# Altium schematic sheet PowerAndClock.SchDoc
size A4
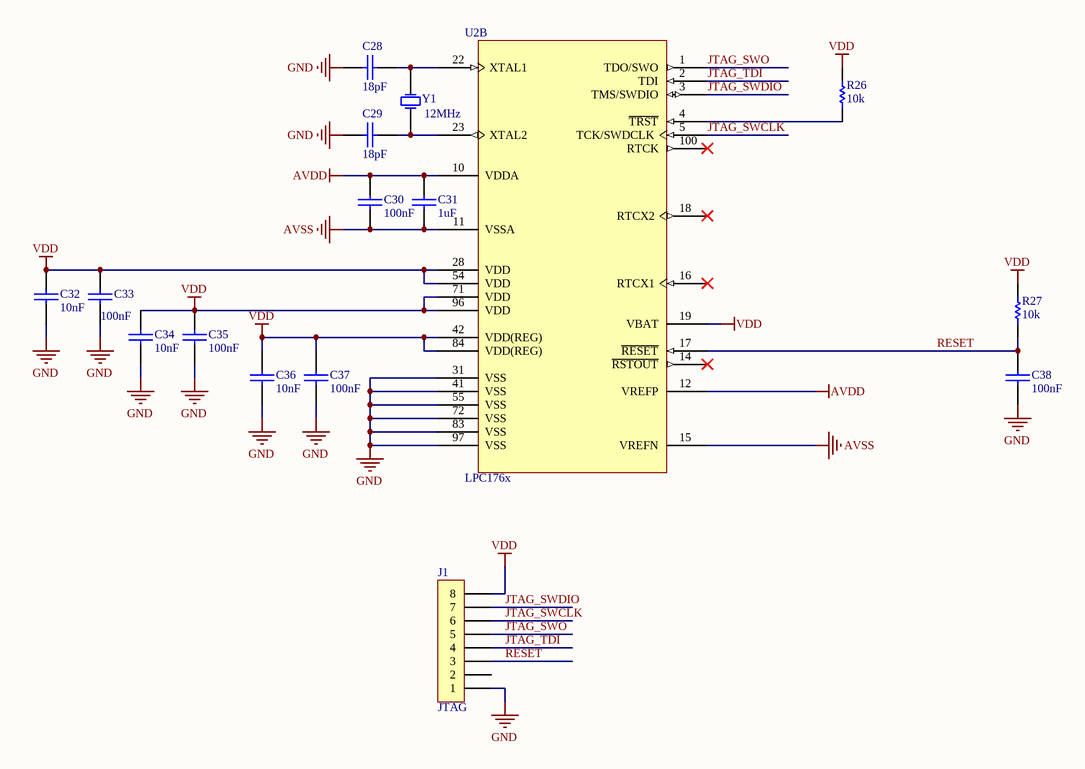
[diagram p0: PowerAndClock.SchDoc]

## Parts
C28  value 18pF  [0805]  (hidden comment: Capacitor)
C29  value 18pF  [0805]  (hidden comment: Capacitor)
C30  value 100nF  [0805]  (hidden comment: Capacitor)
C31  value 1uF  [0805]  (hidden comment: Capacitor)
C32  value 10nF  [0805]  (hidden comment: Capacitor)
C33  value 100nF  [0805]  (hidden comment: Capacitor)
C34  value 10nF  [0805]  (hidden comment: Capacitor)
C35  value 100nF  [0805]  (hidden comment: Capacitor)
C36  value 10nF  [0805]  (hidden comment: Capacitor)
C37  value 100nF  [0805]  (hidden comment: Capacitor)
C38  value 100nF  [0805]  (hidden comment: Capacitor)
J1  JTAG  [SIP8]
R26  value 10k  [0805]  (hidden comment: Resistor)
R27  value 10k  [0805]  (hidden comment: Resistor)
U2  LPC176x  [QFP100]  (part B of 2)
Y1  12MHz  [Cristal SMD]

## Nets
AVDD: C30.1 C31.1 U2.10(VDDA) U2.12(VREFP)
AVSS: C30.2 C31.2 U2.11(VSSA) U2.15(VREFN)
GND: C28.1 C29.1 C32.2 C33.2 C34.2 C35.2 C36.2 C37.2 C38.2 J1.1 U2.31(VSS) U2.41(VSS) U2.55(VSS) U2.72(VSS) U2.83(VSS) U2.97(VSS)
VDD: C32.1 C33.1 C34.1 C35.1 C36.1 C37.1 J1.8 R26.2 R27.2 U2.19(VBAT) U2.28(VDD) U2.42(VDD(REG)) U2.54(VDD) U2.71(VDD) U2.84(VDD(REG)) U2.96(VDD)
JTAG_SWCLK: J1.6 U2.5(TCK/SWDCLK)
JTAG_SWDIO: J1.7 U2.3(TMS/SWDIO)
JTAG_SWO: J1.5 U2.1(TDO/SWO)
JTAG_TDI: J1.4 U2.2(TDI)
RESET: C38.1 J1.3 R27.1 U2.17(~{RESET})
NetC28_2: C28.2 U2.22(XTAL1) Y1.2(OSC2)
NetC29_2: C29.2 U2.23(XTAL2) Y1.1(OSC1)
NetR26_1: R26.1 U2.4(~{TRST})

Not connected (* = marked no-connect by the designer): J1 2; U2 14(~{RSTOUT})* 16(RTCX1)* 18(RTCX2)* 100(RTCK)*

## Library data of the parts
J1 = CON8
U2 = LPC_17x: LPC176x Microcontroller
Y1 = XTAL: Crystal Oscillator; Published: 8-Jun-2000; LatestRevisionDate: 17-Jul-2002; LatestRevisionNote: Re-released for DXP Platform.; PackageReference: R38; Publisher: Altium Limited; PackageDescription: Crystal, Thru-Hole; 2 Leads; Body 3.1 x 8.2 mm (Dia.xH)
C28-C38 = Capacitor: Dielectric: *; Voltage: *